# Altium schematic sheet FPGA_Components.SchDoc
size A; DocumentNumber: 7; SheetNumber: 7; SheetTotal: 8; PageSetup: Record=PageOptions|CenterHorizontal=True|CenterVertical=True|PrintScale=1.12|XCorrection=1.00|YCorrection=1.00|PrintKind=0|BorderSize=5000000|LeftOffset=0|BottomOffset=0|Orientation=2|PaperLength=1000|PaperWidth=1000|Scale=100|PaperSource=7|PrintQuality=-4|MediaType=1|DitherType=10|PaperKind=Letter|PrintScaleMode=1
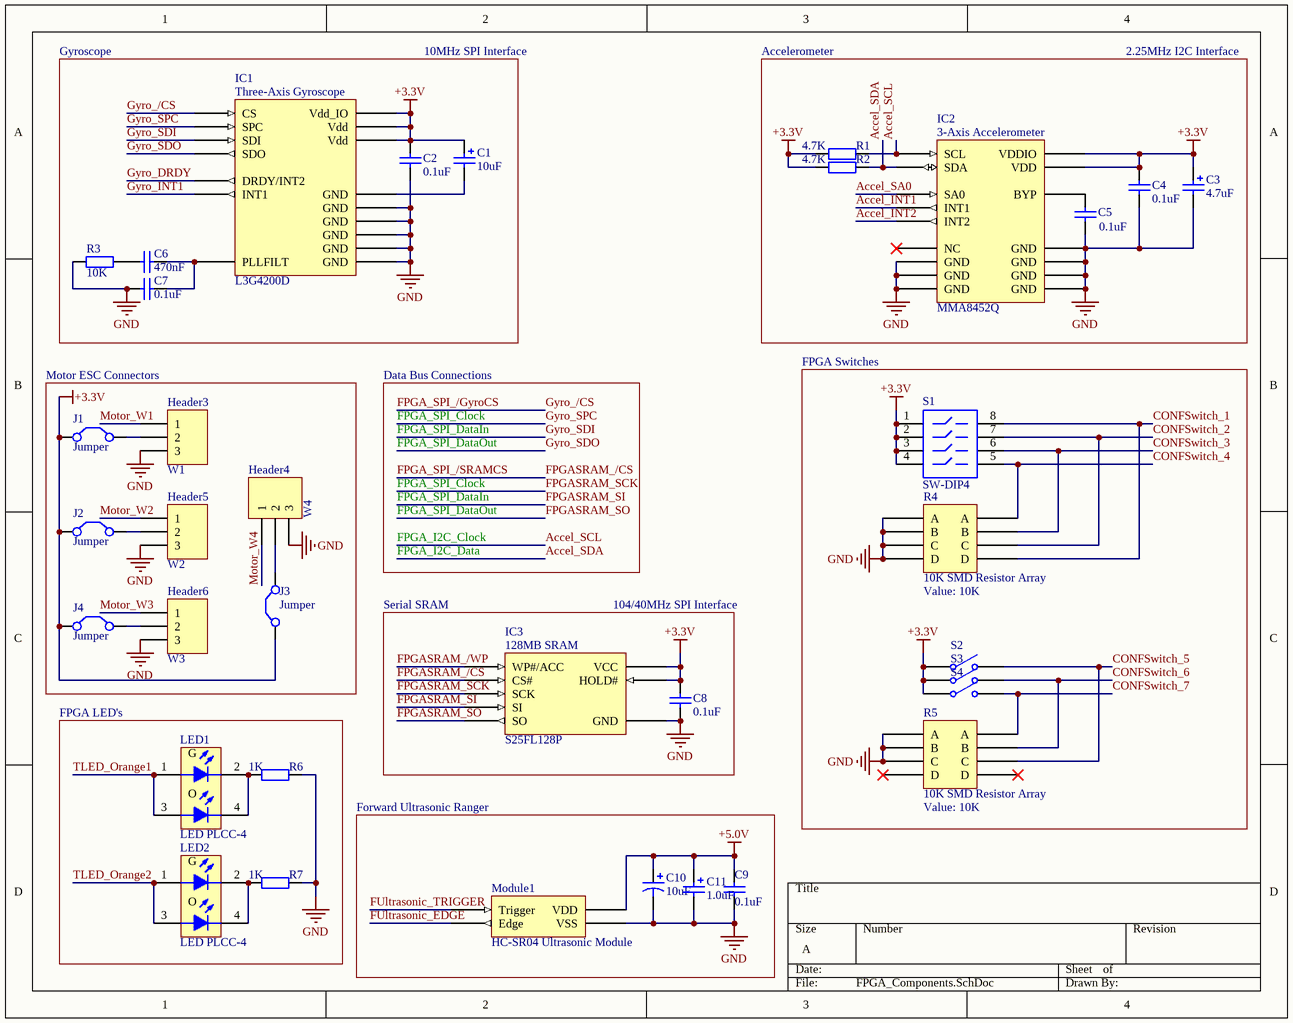
[diagram p0: FPGA_Components.SchDoc]

## Parts
C1  value 10uF  [Capacitor - Tantalum Case A]  (hidden comment: 10uF Low-ESR Tantalum CaseA)
C2  value 0.1uF  [SMD 1206]  (hidden comment: 0.1uF SMD 1206)
C3  value 4.7uF  [Capacitor - Tantalum Case A]  (hidden comment: 4.7uF Low-ESR Tantalum CaseA)
C4  value 0.1uF  [SMD 1206]  (hidden comment: 0.1uF SMD 1206)
C5  value 0.1uF  [SMD 1206]  (hidden comment: 0.1uF SMD 1206)
C6  value 470nF  [SMD 0603]  (hidden comment: 470nF SMD 0603)
C7  value 0.1uF  [SMD 1206]  (hidden comment: 0.1uF SMD 1206)
C8  value 0.1uF  [SMD 1206]  (hidden comment: 0.1uF SMD 1206)
C9  value 0.1uF  [SMD 1206]  (hidden comment: 0.1uF SMD 1206)
C10  value 10uF  [CAPPR2-5x5]  (hidden comment: 10uF Electrolitic)
C11  value 1.0uF  [Capacitor - Tantalum Case A]  (hidden comment: 1.0uF Low-ESR Tantalum CaseA)
Header3  W1  [HDR1X3H]
Header4  W4  [HDR1X3H]
Header5  W2  [HDR1X3H]
Header6  W3  [HDR1X3H]
IC1  L3G4200D  [L3G4200DTR]
IC2  MMA8452Q  [MMA8452QT]
IC3  S25FL128P  [S25FL128P]
J1  Jumper  [HDR1X2]
J2  Jumper  [HDR1X2]
J3  Jumper  [HDR1X2]
J4  Jumper  [HDR1X2]
LED1  LED PLCC-4  [PLCC-4 LED]
LED2  LED PLCC-4  [PLCC-4 LED]
Module1  HC-SR04 Ultrasonic Module  [HC-SR04 Ultrasonic Ranger]
R1  value 4.7K  [SMD 0805]  (hidden comment: 4.7K SMD 0805)
R2  value 4.7K  [SMD 0805]  (hidden comment: 4.7K SMD 0805)
R3  value 10K  [SMD 0805]  (hidden comment: 10K SMD 0805)
R4  10K SMD Resistor Array  value 10K  [Resistor Array YC164]
R5  10K SMD Resistor Array  value 10K  [Resistor Array YC164]
R6  value 1K  [SMD 0805]  (hidden comment: 1K SMD 0805)
R7  value 1K  [SMD 0805]  (hidden comment: 1K SMD 0805)
S1  SW-DIP4  [DIP-8]
S2  SMD Tactile Switch  [SMD Tactile Switch]  (value not drawn)
S3  SMD Tactile Switch  [SMD Tactile Switch]  (value not drawn)
S4  SMD Tactile Switch  [SMD Tactile Switch]  (value not drawn)

## Blocks framed on the sheet
Motor ESC Connectors: Header3-Header6 J1-J4
FPGA Switches: R4 R5 S1-S4
FPGA LED's: LED1 LED2 R6 R7
Forward Ultrasonic Ranger: C9-C11 Module1

## Nets
+3.3V: C1.1(+) C2.2 C3.1(+) C4.1 C8.1 IC1.0(Vdd_IO) IC1.14(Vdd) IC1.15(Vdd) IC2.0(VDDIO) IC2.13(VDD) IC3.6(HOLD#) IC3.7(VCC) J1.1(C1) J2.1(C1) J3.1(C1) J4.1(C1) R1.2 R2.1 S1.1 S1.2 S1.3 S1.4 S2.1(COMMON) S3.1(COMMON) S4.1(COMMON)
+5.0V: C9.2 C10.1 C11.1(+) Module1.0(VDD)
GND: C2.1 C3.2(-) C4.2 C5.1 C7.2 C8.2 C9.1 C10.2 C11.2(-) Header3.3 Header4.3 Header5.3 Header6.3 IC1.7(GND) IC1.8(GND) IC1.9(GND) IC1.10(GND) IC1.11(GND) IC2.4(GND) IC2.7(GND) IC2.9(GND) IC2.11(GND) IC2.12(GND) IC2.14(GND) IC2.15(GND) IC3.3(GND) Module1.3(VSS) R3.2 R4.5(A) R4.6(B) R4.7(C) R4.8(D) R5.5(A) R5.6(B) R5.7(C) R6.2 R7.2
Accel_INT1: IC2.10(INT1)
Accel_INT2: IC2.8(INT2)
Accel_SA0: IC2.6(SA0)
Accel_SCL: IC2.3(SCL) R1.1  [also labelled FPGA_I2C_Clock]
Accel_SDA: IC2.5(SDA) R2.2  [also labelled FPGA_I2C_Data]
CONFSwitch_1: R4.4(D) S1.8
CONFSwitch_2: R4.3(C) S1.7
CONFSwitch_3: R4.2(B) S1.6
CONFSwitch_4: R4.1(A) S1.5
CONFSwitch_5: R5.3(C) S2.2(NO)
CONFSwitch_6: R5.2(B) S3.2(NO)
CONFSwitch_7: R5.1(A) S4.2(NO)
FPGA_SPI_/GyroCS: IC1.4(CS)  [also labelled Gyro_/CS]
FPGA_SPI_/SRAMCS: IC3.0(CS#)  [also labelled FPGASRAM_/CS]
FPGA_SPI_Clock: IC1.1(SPC) IC3.5(SCK)  [also labelled FPGASRAM_SCK, Gyro_SPC]
FPGA_SPI_DataIn: IC1.2(SDI) IC3.4(SI)  [also labelled FPGASRAM_SI, Gyro_SDI]
FPGA_SPI_DataOut: IC1.3(SDO) IC3.1(SO)  [also labelled FPGASRAM_SO, Gyro_SDO]
FPGASRAM_/WP: IC3.2(WP#/ACC)
FUltrasonic_EDGE: Module1.2(Edge)
FUltrasonic_TRIGGER: Module1.1(Trigger)
Gyro_DRDY: IC1.5(DRDY/INT2)
Gyro_INT1: IC1.6(INT1)
Motor_W1: Header3.1
Motor_W2: Header5.1
Motor_W3: Header6.1
Motor_W4: Header4.1
TLED_Orange1: LED1.1(A1) LED1.3(A2)
TLED_Orange2: LED2.1(A1) LED2.3(A2)
NetC1_2: C1.2(-) IC1.12(GND)
NetC5_2: C5.2 IC2.1(BYP)
NetC6_1: C6.1 C7.1 IC1.13(PLLFILT)
NetC6_2: C6.2 R3.1
NetHeader3_2: Header3.2 J1.2(C2)
NetHeader4_2: Header4.2 J3.2(C2)
NetHeader5_2: Header5.2 J2.2(C2)
NetHeader6_2: Header6.2 J4.2(C2)
NetLED1_2: LED1.2(K1) LED1.4(K2) R6.1
NetLED2_2: LED2.2(K1) LED2.4(K2) R7.1

Not connected (* = marked no-connect by the designer): IC2 2(NC)*; R5 4(D)* 8(D)*

## Notes on the sheet
- Gyroscope
- 10MHz SPI Interface
- Accelerometer
- 2.25MHz I2C Interface
- Data Bus Connections
- Serial SRAM
- 104/40MHz SPI Interface
- (in symbol HSMF-C157) G; O
- (in symbol L3G4200D) Three-Axis Gyroscope
- (in symbol MMA8452Q) 3-Axis Accelerometer
- (in symbol S25FL128P) 128MB SRAM

## Library data of the parts
C1 C3 C11 = SMD_Cap_Tantalum: Tantalum Capacitor - Case A
C2 C4-C9 = Cap: Capacitor
C10 = Cap Pol1: Polarized Capacitor (Radial); Published: 8-Jun-2000; LatestRevisionDate: 17-Jul-2002; LatestRevisionNote: Re-released for DXP Platform.; PackageReference: RB7.6-15; Publisher: Altium Limited; PackageDescription: Polarized Capacitor (Radial); 2 Leads
Header3-Header6 = Header 3H: Header, 3-Pin, Right Angle; LatestRevisionDate: 17-Jul-2002; LatestRevisionNote: Re-released for DXP Platform.; Publisher: Altium Limited
IC1 = L3G4200D: Three-Axis Digital Output MEMS Gyroscope; pin to pad: 0>1 1>2 2>3 3>4 4>5 5>6 6>7 7>8 8>9 9>10 10>11 11>12 12>13 13>14 14>15 15>16
IC2 = MMA8452Q: 3-Axis, 12-bit/8-bit Digital Accelerometer; pin to pad: 0>1 1>2 2>3 3>4 4>5 5>6 6>7 7>8 8>9 9>10 10>11 11>12 12>13 13>14 14>15 15>16
IC3 = S25FL128P: 128MB 104-MHz SPI Flash Memory; pin to pad: 0>1 1>2 2>3 3>4 4>5 5>6 6>7 7>8
J1-J4 = Jumper: Jumper Wire; Published: 24-Mar-1999; LatestRevisionDate: 17-Jul-2002; LatestRevisionNote: Re-released for DXP Platform.; PackageReference: RAD-0.2; Publisher: Altium Limited; PackageDescription: Radial Cap, Thru-Hole; 2 Leads; 0.2 in Pin Spacing
LED1 LED2 = HSMF-C157: Surface Mount Chip LED; pin to pad: 1>2 2>1; LuminousIntensity: 2.5mcd (Minimum).; LED_Colour: Orange & Green; PCB_Layout: Complies with manufacturer's recommendation.; Published: 11-Dec-2002; DatasheetVersion: 18-Apr-2002; PackageVersion: 18-Apr-2002; PackageReference: 3.2X2.7X1.1; Publisher: Altium Limited; PackageDescription: SM LED, Bi-Colour; 4 Flat Leads; Body 3.2 x 2.7 x 1.1 mm (LxWxH); ComponentLink1Description: Manufacturer Link; ComponentLink1URL: http://www.avagotech.com/; ComponentLink2Description: Datasheet; ComponentLink2URL: http://cp.literature.agilent.com/litweb/pdf/5988-6268EN.pdf
Module1 = HC-SR04 Ultrasonic Module: pin to pad: 0>1 1>2 2>3 3>4
R1-R3 R6 R7 = Res2: Resistor
R4 R5 = SMD Resistor Array: 4-Count Resistor Array; pin to pad: 5>8 6>7 7>6 8>5
S1 = SW-DIP4: DIP Switch; Published: 24-Mar-1999; LatestRevisionDate: 17-Jul-2002; LatestRevisionNote: Re-released for DXP Platform.; PackageReference: DIP-8; Publisher: Altium Limited
S2-S4 = SW-SPST: Single-Pole, Single-Throw Switch; Published: 24-Mar-1999; LatestRevisionDate: 17-Jul-2002; LatestRevisionNote: Re-released for DXP Platform.; PackageReference: SPST-2; Publisher: Altium Limited; PackageDescription: Switch; 2 Leads